# EAGLE design crystalLEDControl (EAGLE 7.7.0)
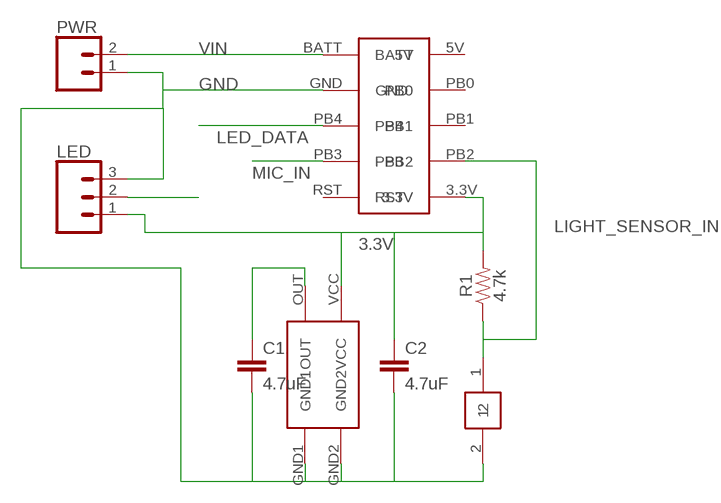
[diagram p0: schematic, sheet 1]

## Parts
A1  SPW2430  [SPW2430]
C1  4.7uF  4.7UF0603  [0603]
C2  4.7uF  4.7UF0603  [0603]
LED  CONN_03  [1X03]
MCU1  ARDUINO_TRINKET  [ARDUINO_TRINKET]
PC1  PDV-P8101  [PHOTOCELL_CERAMIC]
PWR  CONN_02  [1X02]
R1  4.7k  4.7KOHM-0603-1/10W-1%  [0603]

## Nets
3.3V: A1.VCC C2.1 LED.1 MCU1.3.3V R1.2
GND: A1.GND1 A1.GND2 C1.2 C2.2 LED.3 MCU1.GND PC1.2 PWR.1
LED_DATA: LED.2 MCU1.PB4
LIGHT_SENSOR_IN: MCU1.PB2 PC1.1 R1.1
MIC_IN: A1.OUT C1.1 MCU1.PB3
VIN: MCU1.BATT PWR.2
Unconnected: MCU1.5V MCU1.PB0 MCU1.PB1 MCU1.RST

## Library data of the parts
A1 = freddyLibr:SPW2430: Surface mount microphone outputting analog voltage.
C1 C2 = SparkFun-Capacitors:4.7UF: 4.7µF ceramic capacitors A capacitor is a passive two-terminal electrical component used to store electrical energy temporarily in an electric field.; PROD_ID: CAP-08280
LED = SparkFun-Connectors:CONN_03: Multi connection point. Often used as Generic Header-pin footprint for 0.1 inch spaced/style header connections On any of the 0.1 inch spaced packages, you can populate with these: Break Away Headers - Straight <https://www.sparkfun.com/products/116> (PRT-00116) Break Away Male Headers - Right Angle <https://www.sparkfun.com/products/553> (PRT-00553) Female Headers <https://www.sparkfun.com/products/115> (PRT-00115) Break Away Headers - Machine Pin <https://www.sparkfun.com/products/117> (PRT-00117) Break Away Female Headers - Swiss Machine Pin <https://www.sparkfun.com/products/743> (PRT-00743) Stackable Header - 3 Pin (Female, 0.1") <https://www.sparkfun.com/products/13875> (PRT-13875) For SCREWTERMINALS and SPRING TERMINALS visit here: Screw Terimnals on SparkFun.com <https://www.sparkfun.com/search/results?term=Screw+Terminals> (5mm/3.5mm/2.54mm spacing) This device is also useful as a general connection point to wire up your design to another part of your project. Our various solder wires solder well into these plated through hole pads. Hook-Up Wire - Assortment (Stranded, 22 AWG) <https://www.sparkfun.com/products/11375> (PRT-11375) Hook-Up Wire - Assortment (Solid Core, 22 AWG) <https://www.sparkfun.com/products/11367> (PRT-11367) View the entire wire category on our website here <https://www.sparkfun.com/categories/141> Special notes: Molex polarized connector foot print use with SKU : PRT-08232 with associated crimp pins and housings.
MCU1 = trinketLib:ARDUINO_TRINKET: Microcontroller package Arduino Trinket by Adafruit. 3.3V variety.
PC1 = freddyLibr:PDV-P8101: Photocell in ceramic package
PWR = SparkFun-Connectors:CONN_02: Multi connection point. Often used as Generic Header-pin footprint for 0.1 inch spaced/style header connections On any of the 0.1 inch spaced packages, you can populate with these: Break Away Headers - Straight <https://www.sparkfun.com/products/116> (PRT-00116) Break Away Male Headers - Right Angle <https://www.sparkfun.com/products/553> (PRT-00553) Female Headers <https://www.sparkfun.com/products/115> (PRT-00115) Break Away Headers - Machine Pin <https://www.sparkfun.com/products/117> (PRT-00117) Break Away Female Headers - Swiss Machine Pin <https://www.sparkfun.com/products/743> (PRT-00743) For SCREWTERMINALS and SPRING TERMINALS visit here: Screw Terimnals on SparkFun.com <https://www.sparkfun.com/search/results?term=Screw+Terminals> (5mm/3.5mm/2.54mm spacing) This device is also useful as a general connection point to wire up your design to another part of your project. Our various solder wires solder well into these plated through hole pads. Hook-Up Wire - Assortment (Stranded, 22 AWG) <https://www.sparkfun.com/products/11375> (PRT-11375) Hook-Up Wire - Assortment (Solid Core, 22 AWG) <https://www.sparkfun.com/products/11367> (PRT-11367) View the entire wire category on our website here <https://www.sparkfun.com/categories/141> Special notes: Molex polarized connector foot print use with: PRT-08233 with associated crimp pins and housings. 2.54_SCREWTERM for use with PRT-10571. 3.5mm Screw Terminal footprints for PRT-08084 5mm Screw Terminal footprints for use with PRT-08432
R1 = SparkFun-Resistors:4.7KOHM: 4.7kΩ resistor A resistor is a passive two-terminal electrical component that implements electrical resistance as a circuit element. Resistors act to reduce current flow, and, at the same time, act to lower voltage levels within circuits. - Wikipedia; PROD_ID: RES-07857

## Board
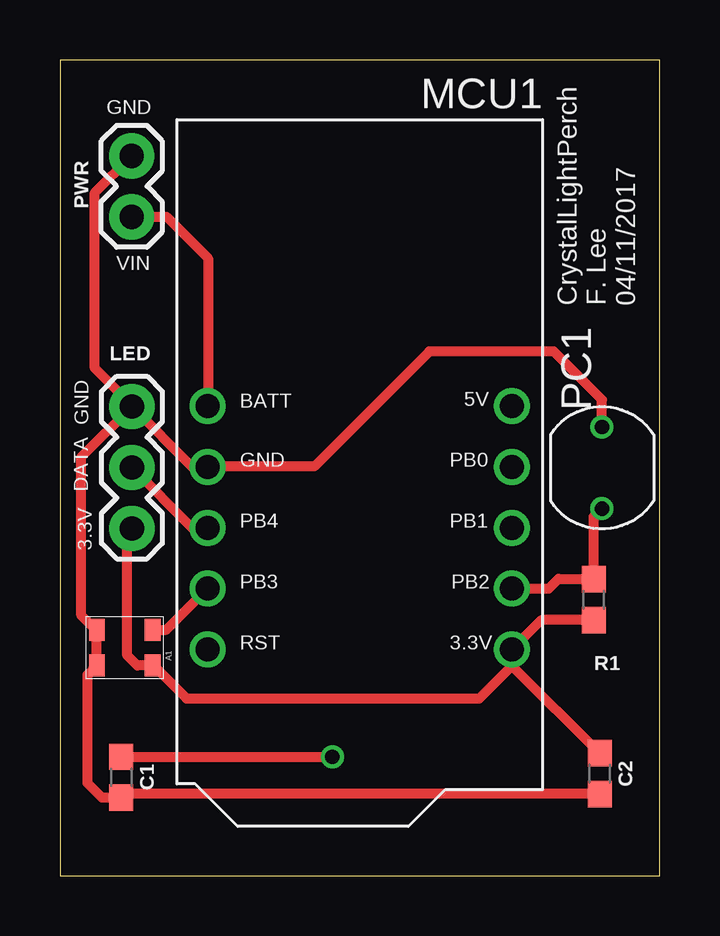
[diagram p1: board, top side]
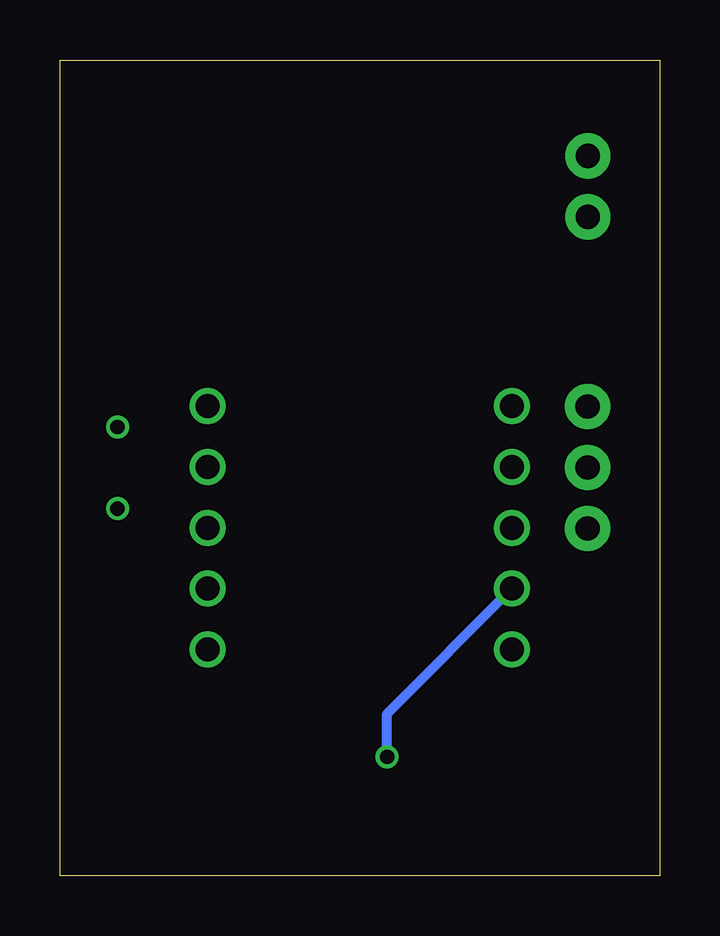
[diagram p2: board, bottom side, seen from below]

Size 25 x 34 mm. Coordinates in mm from the lower left corner, seen from the top.
Outline: 0,0 25,0 25,34 0,34 0,0
Copper layers (1*16): Top 0.0356mm / dielectric 1.5011mm / Bottom 0.0356mm
Design rules "LaenPCBOrder": minimum track width 6mil, minimum drill 13mil, track to track 6mil, track to pad 6mil, pad to pad 6mil, via to via 6mil, smd to smd 6mil, copper to edge 15mil, drill to drill 6mil, minimum pad ring 7mil, minimum via ring 7mil, stop-mask expansion 3mil, vias tented up to drill 0mil, thermal gap 10mil

### Footprints (pad centres in the part's own frame; a part is rotated, then mirrored left to right if it is on the bottom)
SPW2430 = smd 0.9 x 0.66: GND1 -0.74,-1.16; GND2 0.74,-1.16; OUT -0.74,1.16; VCC 0.74,1.16
0603 = smd 1.1 x 1: 1 -0.85,0; 2 0.85,0
1X03 = drill 1.016 pad 1.88: 1 0,0; 2 2.54,0; 3 5.08,0
ARDUINO_TRINKET = drill 1: 3.3V 6.35,-5.08; 5V 6.35,5.08; BATT -6.35,5.08; GND -6.35,2.54; PB0 6.35,2.54; PB1 6.35,0; PB2 6.35,-2.54; PB3 -6.35,-2.54; PB4 -6.35,0; RST -6.35,-5.08
PHOTOCELL_CERAMIC = drill 0.6: 1 0,1.7; 2 0,-1.7
1X02 = drill 1.016 pad 1.88: 1 0,0; 2 2.54,0

### Placement (x,y rotation side)
A1  2.7,9.5 270 top
C1  2.55,4.1 270 top
C2  22.5,4.25 270 top
LED  3,14.47 90 top
MCU1  12.5,14.5 0 top
PC1  22.6,17 180 top
PWR  2.99,30 270 top
R1  22.25,11.5 270 top

### Tracks (layer width: path | path; a pad name or v marks a point on that pad's centre or on a via)
3.3V
  Top 0.406: R1.2 20.08,10.65 MCU1.3.3V 18.85,8.75 | 18.85,8.75 C2.1 | 18.85,8.75 17.48,7.38 5.28,7.38 3.9,8.76 A1.VCC 3.22,8.76 2.81,9.17 2.81,14.28 LED.1
GND
  Top 0.406: LED.3 5.51,17.04 MCU1.GND 6.17,17.06 10.61,17.06 15.4,21.85 20.59,21.85 22.6,19.84 PC1.2 | C2.2 2.7,3.4 C1.2 1.75,3.25 1.15,3.85 1.15,8.37 A1.GND2 A1.GND1 1.49,10.24 0.89,10.84 0.89,17.44 LED.3 | LED.3 3,19.6 1.45,21.15 1.45,28.46 PWR.1
LED_DATA
  Top 0.406: MCU1.PB4 5.51,14.5 LED.2
LIGHT_SENSOR_IN
  Top 0.406: MCU1.PB2 20.38,11.96 20.79,12.37 22.23,12.37 R1.1 22.25,14.95 PC1.1
MIC_IN  (via drill 0.6)
  Top 0.406: A1.OUT 4.43,10.24 MCU1.PB3 | C1.1 v11.36,4.95
  Bottom 0.406: v11.36,4.95 11.36,6.75 MCU1.PB3
VIN
  Top 0.406: PWR.2 4.44,27.46 6.17,25.73 6.17,19.6 MCU1.BATT

### Text on the board
tNames: GND | VIN | CrystalLightPerch / F. Lee / 04/11/2017 | GND | DATA | 3.3V